# EAGLE design ISA Ouderen - Lamp Ontvanger (EAGLE 6.4)
ABBREV: jn6; PROJECT: JeeNode v6
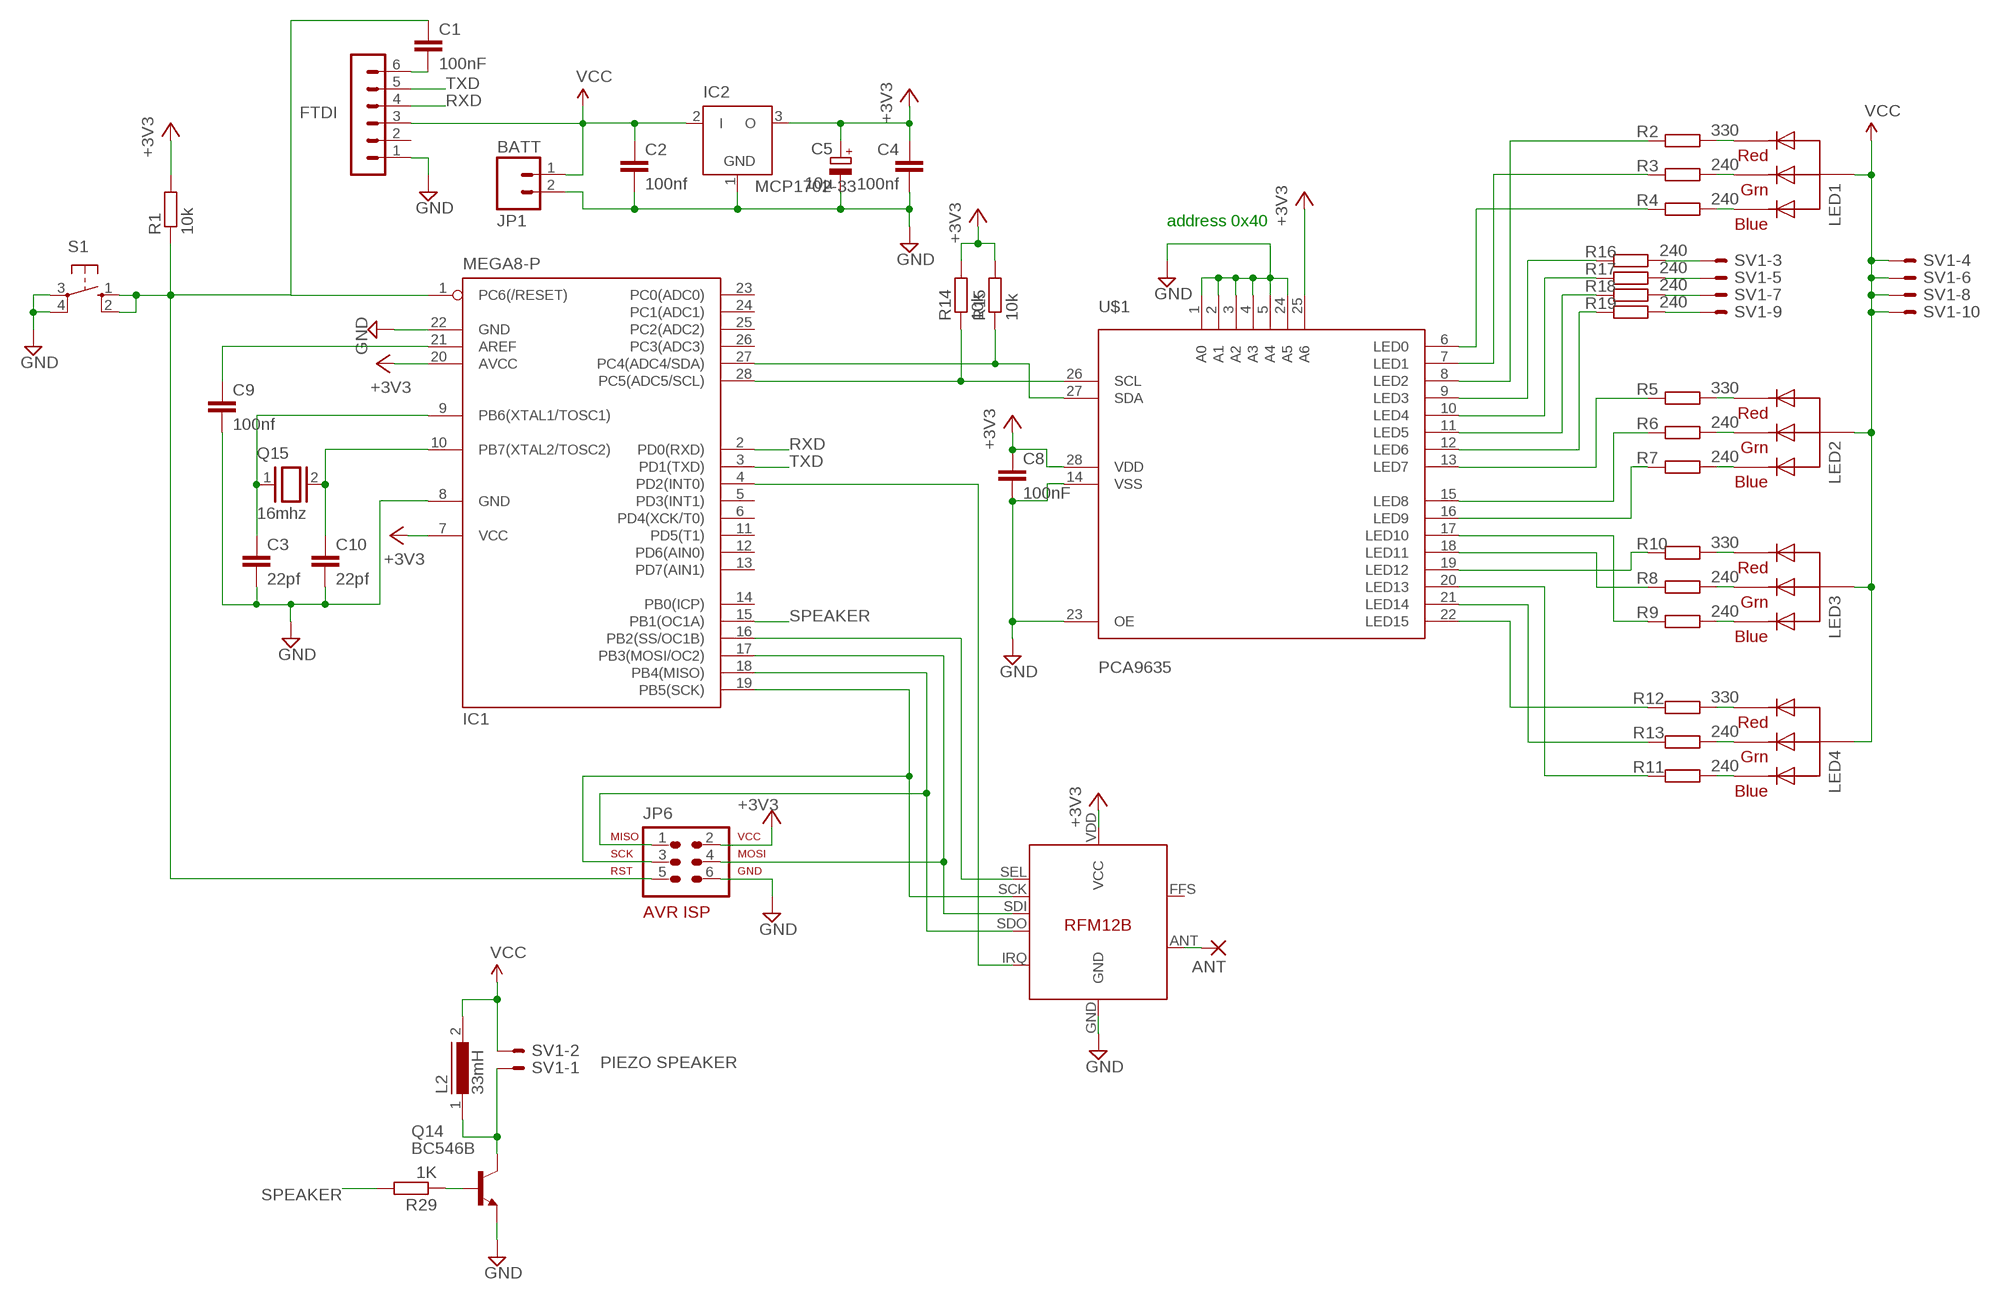
[diagram p0: schematic, sheet 1]

## Parts
ANT  1,6/0,8  [1,6/0,8]
C1  100nF  C-EU025-024X044  [C025-024X044]
C2  100nf  C-EU025-024X044  [C025-024X044]
C3  22pf  C-EU025-024X044  [C025-024X044]
C4  100nf  C-EU025-024X044  [C025-024X044]
C5  10µ  CPOL-EUE1.8-4  [E1,8-4]
C8  100nF  C-EU025-024X044  [C025-024X044]
C9  100nf  C-EU025-024X044  [C025-024X044]
C10  22pf  C-EU025-024X044  [C025-024X044]
FTDI  FTDI  MA06-1  [MA06-1]
IC1  MEGA8-P  [DIL28-3]
IC2  MCP1702-33  MCP1702Z  [TO92]
JP1  BATT  M02LOCK_LONGPADS  [1X02_LOCK_LONGPADS]
JP6  AVR-ISP-6VERT  [AVR-ISP-6]
L2  33mH  82114R  [82114R]
LED1  RGBLED_CA-5MM  [LED5MMRGB]
LED2  RGBLED_CA-5MM  [LED5MMRGB]
LED3  RGBLED_CA-5MM  [LED5MMRGB]
LED4  RGBLED_CA-5MM  [LED5MMRGB]
Q14  BC546B  [TO92-EBC]
Q15  16mhz  XTAL/S  [QS]
R1  10k  R-EU_0207/7  [0207/7]
R2  330  R-EU_0207/7  [0207/7]
R3  240  R-EU_0207/7  [0207/7]
R4  240  R-EU_0207/7  [0207/7]
R5  330  R-EU_0207/7  [0207/7]
R6  240  R-EU_0207/7  [0207/7]
R7  240  R-EU_0207/7  [0207/7]
R8  240  R-EU_0207/7  [0207/7]
R9  240  R-EU_0207/7  [0207/7]
R10  330  R-EU_0207/7  [0207/7]
R11  240  R-EU_0207/7  [0207/7]
R12  330  R-EU_0207/7  [0207/7]
R13  240  R-EU_0207/7  [0207/7]
R14  10k  R-EU_0207/7  [0207/7]
R15  10k  R-EU_0207/7  [0207/7]
R16  240  R-EU_0207/2V  [0207/2V]
R17  240  R-EU_0207/2V  [0207/2V]
R18  240  R-EU_0207/2V  [0207/2V]
R19  240  R-EU_0207/2V  [0207/2V]
R29  1K  R-EU_0207/7  [0207/7]
S1  10-XX  [B3F-10XX]
SV1  ML10LE  [ML10L]
U$1  PCA9635  [PCA9635]
U$3  RFM12B  [RFM12B]

## Nets
+3V3: C4.1 C5.+ C8.1 IC1.7(VCC) IC1.20(AVCC) IC2.3(O) JP6.2 R1.2 R14.2 R15.2 U$1.25(A6) U$1.28(VDD) U$3.VDD(VCC)
GND [power]: C2.2 C3.2 C4.2 C5.- C8.2 C9.2 C10.2 FTDI.1 IC1.8(GND) IC1.22(GND) IC2.1(GND) JP1.2 JP6.6 Q14.E S1.3(P) S1.4(P1) U$1.1(A0) U$1.2(A1) U$1.3(A2) U$1.4(A3) U$1.5(A4) U$1.14(VSS) U$1.23(OE) U$1.24(A5) U$3.GND
N$1: C3.1 IC1.9(PB6(XTAL1/TOSC1)) Q15.1
N$2: IC1.28(PC5(ADC5/SCL)) R14.1 U$1.26(SCL)
N$3: ANT.1(P) U$3.ANT
N$4: IC1.16(PB2(SS/OC1B)) U$3.SEL
N$5: LED1.1(RED) R2.2
N$6: LED1.3(GREEN) R3.2
N$7: IC1.4(PD2(INT0)) U$3.IRQ
N$8: LED1.4(BLUE) R4.2
N$9: LED2.1(RED) R5.2
N$10: IC1.27(PC4(ADC4/SDA)) R15.1 U$1.27(SDA)
N$11: LED2.3(GREEN) R6.2
N$12: LED2.4(BLUE) R7.2
N$13: IC1.18(PB4(MISO)) JP6.1 U$3.SDO
N$14: LED3.1(RED) R10.2
N$15: LED3.3(GREEN) R8.2
N$16: LED3.4(BLUE) R9.2
N$17: LED4.1(RED) R12.2
N$18: LED4.3(GREEN) R13.2
N$19: IC1.19(PB5(SCK)) JP6.3 U$3.SCK
N$20: C1.2 FTDI.6
N$21: C10.1 IC1.10(PB7(XTAL2/TOSC2)) Q15.2
N$22: LED4.4(BLUE) R11.2
N$23: R12.1 U$1.22(LED15)
N$24: R13.1 U$1.21(LED14)
N$25: R11.1 U$1.20(LED13)
N$26: R10.1 U$1.19(LED12)
N$27: R16.1 U$1.9(LED3)
N$28: R8.1 U$1.18(LED11)
N$29: R16.2 SV1.3
N$31: R7.1 U$1.16(LED9)
N$32: R17.1 U$1.10(LED4)
N$33: R2.1 U$1.8(LED2)
N$34: R3.1 U$1.7(LED1)
N$35: R4.1 U$1.6(LED0)
N$36: R18.1 U$1.11(LED5)
N$37: R19.1 U$1.12(LED6)
N$38: R9.1 U$1.17(LED10)
N$39: R5.1 U$1.13(LED7)
N$40: R17.2 SV1.5
N$41: R18.2 SV1.7
N$42: R19.2 SV1.9
N$43: R6.1 U$1.15(LED8)
N$49: C9.1 IC1.21(AREF)
N$51: IC1.17(PB3(MOSI/OC2)) JP6.4 U$3.SDI
N$84: L2.1 Q14.C SV1.1
N$85: Q14.B R29.1
RST: C1.1 IC1.1(PC6(/RESET)) JP6.5 R1.1 S1.1(S) S1.2(S1)
RXD: FTDI.4 IC1.2(PD0(RXD))
SPEAKER: IC1.15(PB1(OC1A)) R29.2
TXD: FTDI.5 IC1.3(PD1(TXD))
VCC [power]: C2.1 FTDI.3 IC2.2(I) JP1.1 L2.2 LED1.2(VCC) LED2.2(VCC) LED3.2(VCC) LED4.2(VCC) SV1.2 SV1.4 SV1.6 SV1.8 SV1.10
Unconnected: FTDI.2 IC1.5(PD3(INT1)) IC1.6(PD4(XCK/T0)) IC1.11(PD5(T1)) IC1.12(PD6(AIN0)) IC1.13(PD7(AIN1)) IC1.14(PB0(ICP)) IC1.23(PC0(ADC0)) IC1.24(PC1(ADC1)) IC1.25(PC2(ADC2)) IC1.26(PC3(ADC3)) U$3.FFS

## Notes on the sheet
- address 0x40
- PIEZO SPEAKER

## Library data of the parts
ANT = JeeLabs:1,6/0,8: THROUGH-HOLE PAD
C1-C4 C8-C10 = resistor:C-EU: CAPACITOR, European symbol
C5 = resistor:CPOL-EU: POLARIZED CAPACITOR, European symbol
FTDI = JeeLabs:MA06-1: PIN HEADER
IC1 = atmel:MEGA8-P: MICROCONTROLLER 8 Kbytes FLASH, 1 kbytes SRAM, 512 bytes EEPROM, USART, 4-channel 10 bit ADC, 2-channel 8 bit ADC Pin compatible with Atmega48, ATMega88, ATMega168 Source: avr.lbr; OC_FARNELL: unknown; OC_NEWARK: unknown
IC2 = JeeLabs:MCP1702: 200 mA, Low Power Low Dropout Voltage Regulator
JP1 = SparkFun:M02: Header 2 Standard 2-pin 0.1" header. Use with straight break away headers (SKU : PRT-00116), right angle break away headers (PRT-00553), swiss pins (PRT-00743), machine pins (PRT-00117), and female headers (PRT-00115). Molex polarized connector foot print use with SKU : PRT-08233 with associated crimp pins and housings.
JP6 = avr-7:AVR-ISP-6: AVR ISP-6 Serial Programming Header
L2 = inductors:82114R: INDUCTOR
LED1-LED4 = adafruit:RGBLED_CA: RGB LED, common-anode 5MM Staggered pins 5mm Piranha package http://www.ladyada.net/library/pcb/eaglelibrary.html
Q14 = transistor-npn:BC546*: NPN Transistor
Q15 = special:XTAL/S: CRYSTAL
R1-R19 R29 = resistor:R-EU_: RESISTOR, European symbol
S1 = switch-omron:10-XX: OMRON SWITCH; MPN: B3F-1000; OC_FARNELL: 176432; OC_NEWARK: 36M3542
SV1 = con-ml:ML10LE: HARTING; OC_FARNELL: unknown; OC_NEWARK: unknown
U$1 = NPX PCA9635:PCA9635: 16 pin PWM with 8 bit per-channel PWM, and 7 bit group PWM on I2C bus
U$3 = JeeParts:RFM12B

## Net classes
1 power: width 0.203 mm, clearance 0.254 mm

## Board
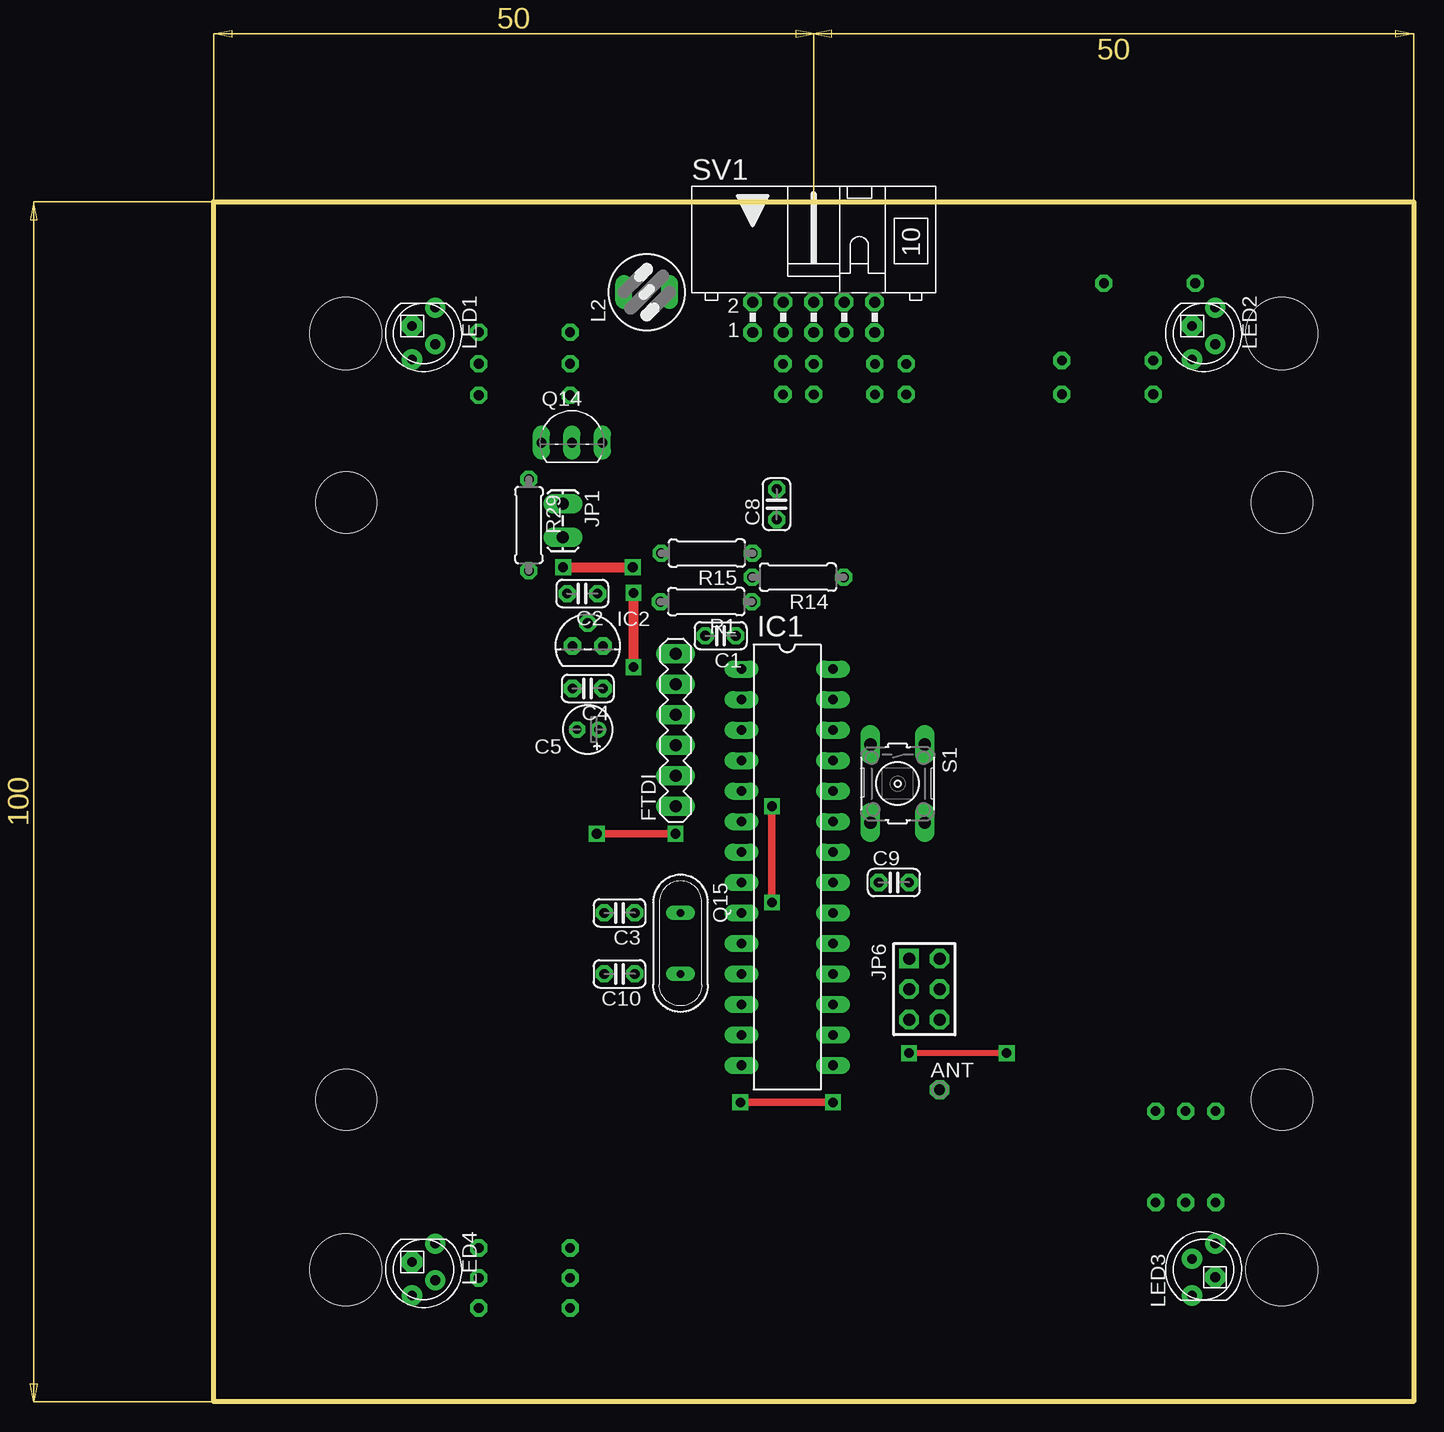
[diagram p1: board, top side]
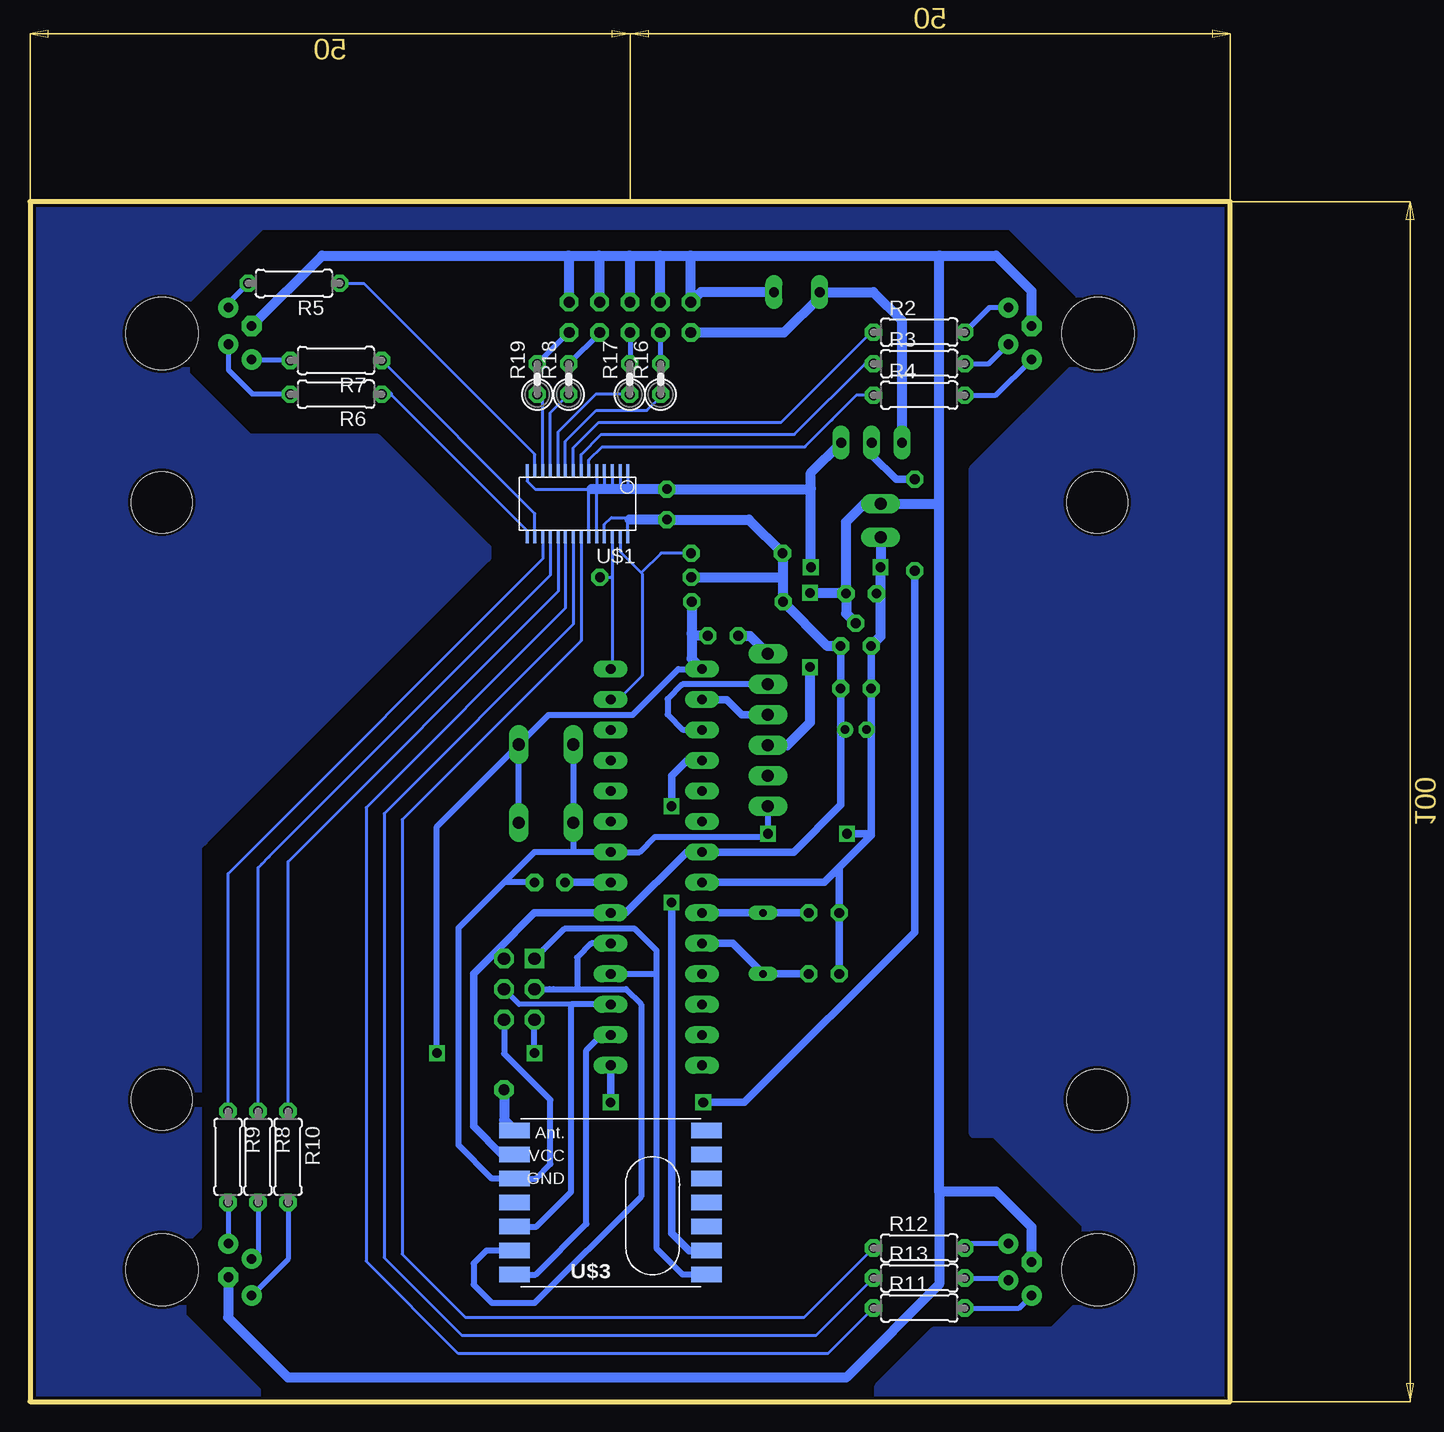
[diagram p2: board, bottom side, seen from below]

Size 100 x 100 mm. Coordinates in mm from the lower left corner, seen from the top.
Outline: 0,0 0,100 100,100 100,0 0,0
Copper layers (1*16): Top 0.035mm / dielectric 1.5mm / Bottom 0.035mm
Design rules "Sparkfun *": minimum track width 8mil, minimum drill 20mil, track to track 8mil, track to pad 8mil, pad to pad 8mil, via to via 8mil, smd to smd 8mil, copper to edge 10mil, drill to drill 8mil, minimum pad ring 12mil, minimum via ring 10mil, stop-mask expansion 4mil, vias tented up to drill 25mil, thermal gap 10mil
Holes 6 mm at 89,89 11,89 89,11 11,11
Holes 5.08 mm at 89.03,74.93 89.03,25.15 11.05,25.15 11.05,74.93

### Footprints (pad centres in the part's own frame; a part is rotated, then mirrored left to right if it is on the bottom)
1,6/0,8 = drill 0.9 pad 1.6 octagon: 1 0,0
C025-024X044 = drill 0.813 octagon: 1 -1.27,0; 2 1.27,0
E1,8-4 = drill 0.711 pad 1.168: + -0.889,0 | drill 0.711 pad 1.168 octagon: - 0.889,0
MA06-1 = drill 1.016 long: 1 0,0; 2 2.54,0; 3 5.08,0; 4 7.62,0; 5 10.16,0; 6 12.7,0
DIL28-3 = drill 0.813 long: 1 -16.51,-3.81; 2 -13.97,-3.81; 3 -11.43,-3.81; 4 -8.89,-3.81; 5 -6.35,-3.81; 6 -3.81,-3.81; 7 -1.27,-3.81; 8 1.27,-3.81; 9 3.81,-3.81; 10 6.35,-3.81; 11 8.89,-3.81; 12 11.43,-3.81; 13 13.97,-3.81; 14 16.51,-3.81; 15 16.51,3.81; 16 13.97,3.81; 17 11.43,3.81; 18 8.89,3.81; 19 6.35,3.81; 20 3.81,3.81; 21 1.27,3.81; 22 -1.27,3.81; 23 -3.81,3.81; 24 -6.35,3.81; 25 -8.89,3.81; 26 -11.43,3.81; 27 -13.97,3.81; 28 -16.51,3.81
TO92 = drill 0.813 octagon: 1 -1.27,0; 2 0,1.905; 3 1.27,0
1X02_LOCK_LONGPADS = drill 1.016 long: 1 -0.127,0; 2 2.667,0
AVR-ISP-6 = drill 1.016 square: 1 -2.54,-1.27 | drill 1.016 octagon: 2 -2.54,1.27; 3 0,-1.27; 4 0,1.27; 5 2.54,-1.27; 6 2.54,1.27
82114R = drill 0.813 long: 1 0,1.905; 2 0,-1.905
LED5MMRGB = drill 0.8 pad 1.676: 1 -2.159,0.968; 3 0.889,0.968; 4 2.159,-0.968 | drill 0.8 pad 1.676 octagon: 2 -0.635,-0.968
TO92-EBC = drill 0.813 long: B 0,-1.27; C -2.54,-1.27; E 2.54,-1.27
QS = drill 0.61 long: 1 -2.54,0; 2 2.54,0
0207/7 = drill 0.813 octagon: 1 -3.81,0; 2 3.81,0
0207/2V = drill 0.813 octagon: 1 -1.27,0; 2 1.27,0
B3F-10XX = drill 1.016 long: 1 -3.251,2.261; 2 3.251,2.261; 3 -3.251,-2.261; 4 3.251,-2.261
ML10L = drill 0.914 octagon: 1 -5.08,-1.27; 2 -5.08,1.27; 3 -2.54,-1.27; 4 -2.54,1.27; 5 0,-1.27; 6 0,1.27; 7 2.54,-1.27; 8 2.54,1.27; 9 5.08,-1.27; 10 5.08,1.27
PCA9635 = smd 0.25 x 1: 1 0.65,-0.6; 2 1.3,-0.6; 3 1.95,-0.6; 4 2.6,-0.6; 5 3.25,-0.6; 6 3.9,-0.6; 7 4.55,-0.6; 8 5.2,-0.6; 9 5.85,-0.6; 10 6.45,-0.6; 11 7.1,-0.6; 12 7.75,-0.6; 13 8.4,-0.6; 14 9.05,-0.6; 15 9.05,5; 16 8.4,5; 17 7.75,5; 18 7.1,5; 19 6.45,5; 20 5.85,5; 21 5.2,5; 22 4.55,5; 23 3.9,5; 24 3.25,5; 25 2.6,5; 26 1.95,5; 27 1.3,5; 28 0.65,5
RFM12B = smd 2.54 x 1.27: ANT 8,-6; FFS -8,2; GND 8,-2; IRQ -8,4; P$8 -8,0; P$9 -8,-2; P$10 -8,-4; P$12 -8,-6; P$16 8,0; SCK 8,4; SDI 8,2; SDO -8,6; SEL 8,6; VDD 8,-4

### Placement (x,y rotation side)
ANT  60.5,25.99 0 top
C1  42.25,63.82 180 top
C2  30.73,67.34 180 top
C3  33.83,40.72 180 top
C4  31.18,59.43 180 top
C5  31.18,56 180 top
C8  46.92,74.77 90 top
C9  56.69,43.26 0 top
C10  33.83,35.64 180 top
FTDI  38.51,49.61 90 top
IC1  47.8,44.53 270 top
IC2  31.18,62.96 0 top
JP1  29.11,74.69 270 top
JP6  59.23,34.37 270 top
L2  36.1,92.45 90 top
LED1  17.5,89 270 top
LED2  82.5,89 270 top
LED3  82.5,11 90 top
LED4  17.5,11 270 top
Q14  29.86,81.18 0 top
Q15  38.91,38.18 270 top
R1  41.05,66.66 180 top
R2  25.9,89.12 0 bottom
R3  25.9,86.49 0 bottom
R4  25.9,83.87 0 bottom
R5  78,93.19 180 bottom
R6  74.5,83.95 180 bottom
R7  74.5,86.76 180 bottom
R8  81,20.4 270 bottom
R9  83.5,20.4 270 bottom
R10  78.5,20.4 270 bottom
R11  25.9,7.8 0 bottom
R12  25.9,12.8 0 bottom
R13  25.9,10.3 0 bottom
R14  48.7,68.7 180 top
R15  41.1,70.7 180 top
R16  47.45,85.2 90 bottom
R17  50.02,85.2 90 bottom
R18  55.11,85.2 90 bottom
R19  57.73,85.2 90 bottom
R29  26.27,73.04 270 top
S1  57,51.5 270 top
SV1  50,90.36 0 top
U$1  49.53,77.01 180 bottom
U$3  51.61,16.59 180 bottom

### Tracks (layer width: path | path; a pad name or v marks a point on that pad's centre or on a via)
+3V3
  Bottom 0.254: U$1.28 50.18,73.36 50.04,73.5 | U$1.25 52.13,73.09 51.56,73.66 49.94,73.66 49.78,73.5
  Bottom 0.61: 61.13,37.55 57.96,40.72 IC1.20 50.34,40.72 45.26,45.8 IC1.7 36.37,45.8 32.45,49.72 32.45,55.88 | 61.13,37.55 63.04,35.64 63.04,22.94 60.69,20.59 U$3.VDD | JP6.2 61.13,37.55 | IC2.3 C4.1 32.45,55.88 | C5.+ 32.33,56 32.45,55.88
  Bottom 0.813: 37.2,70.61 R15.2 | 37.24,68.6 R1.2 33.54,62.96 IC2.3 | 37.24,68.6 37.24,70.65 R15.2 | R14.2 37.34,68.7 37.24,68.6 | R15.2 40.09,73.5 C8.1 49.78,73.5 50.04,73.5
GND  (via drill 0.8)
  Top 0.61: v38.49,47.32 v31.93,47.32
  Top 0.813: v29.13,69.53 v34.93,69.53
  Bottom 0.254: U$1.14 58.58,76.71 57.91,76.04 53.09,76.04 | U$1.1 50.18,76.28 50.42,76.04 | U$1.2 50.83,76.07 50.8,76.04 | U$1.3 51.48,76.21 51.31,76.04 | U$1.4 52.13,76.11 52.2,76.04 | U$1.5 52.78,76.09 52.83,76.04 52.78,75.99 U$1.24 | U$1.23 53.43,75.82 53.21,76.04
  Bottom 0.508: 54.86,45.8 IC1.22 49.2,45.8 47.93,47.07 38.75,47.07 v38.49,47.32 38.51,47.34 FTDI.1 | 54.86,45.8 57.96,45.8 60.5,43.26 | 60.5,43.26 64.31,39.45 64.31,21.38 61.52,18.59 U$3.GND 57.86,18.59 56.64,19.81 56.64,25.15 60.5,29 JP6.6 | C9.2 60.5,43.26 | S1.3 S1.4 54.74,45.92 54.86,45.8
  Bottom 0.61: C10.2 C3.2 32.56,44.37 32.64,44.45 | IC2.1 C4.2 29.91,56.01 | 29.91,56.01 29.91,47.5 | 29.91,47.5 29.91,47.18 32.64,44.45 | C5.- 29.92,56 29.91,56.01 | 32.64,44.45 33.83,43.26 IC1.8 | v31.93,47.32 30.08,47.32 29.91,47.5
  Bottom 0.813: v29.13,69.53 29.13,69 | 29.13,69 29.13,67.4 | C2.2 29.2,67.34 29.13,67.4 | v34.93,69.53 34.93,76.07 | 34.93,76.07 34.93,77.39 Q14.E | JP1.2 29.11,69.02 29.13,69 | 34.93,76.07 34.96,76.04 C8.2 50.42,76.04 50.8,76.04 51.31,76.04 52.2,76.04 52.83,76.04 53.09,76.04 53.21,76.04 | 29.13,67.4 29.13,63.74 IC2.1
N$1
  Bottom 0.61: IC1.9 Q15.1 C3.1
N$2
  Bottom 0.254: U$1.26 51.48,68.8 | 51.48,68.8 51.48,61.17 IC1.28 | R14.1 51.58,68.7 51.48,68.8
N$3
  Bottom 0.813: ANT.1 60.5,23.48 U$3.ANT
N$4
  Bottom 0.508: U$3.SEL 57.86,10.59 53.64,14.81 53.64,29.29 52.37,30.56 IC1.16
N$5
  Bottom 0.406: LED1.1 20.05,91.16 R2.2
N$6
  Bottom 0.406: R3.2 20.09,86.49 LED1.3
N$7  (via drill 0.8)
  Top 0.61: v46.53,49.61 v46.53,41.59
  Bottom 0.61: IC1.4 45.26,53.42 46.53,52.15 v46.53,49.61 | v46.53,41.59 46.53,14.05 45.07,12.59 U$3.IRQ
N$8
  Bottom 0.406: R4.2 19.51,83.87 LED1.4
N$9
  Bottom 0.406: LED2.1 83.47,91.53 R5.2
N$10
  Bottom 0.254: U$1.27 50.83,70.83 49.05,69.06 | IC1.27 51,58.5 49,60.5 49,69 49.05,69.06 | R15.1 47.41,70.7 49.05,69.06
N$11
  Bottom 0.406: LED2.3 83.47,85.98 81.44,83.95 R6.2
N$12
  Bottom 0.406: R7.2 81.45,86.76 LED2.4
N$13
  Bottom 0.508: 47.8,35.6 47.8,37.6 49.6,39.4 55.47,39.4 JP6.1 | 47.8,35.6 47.8,12.78 45.61,10.59 U$3.SDO | IC1.18 47.84,35.64 47.8,35.6
N$14
  Bottom 0.406: R10.2 78.5,11.87 LED3.1
N$15
  Bottom 0.406: R8.2 81,12.42 LED3.3
N$16
  Bottom 0.406: R9.2 83.5,13.19 LED3.4
N$17
  Bottom 0.406: LED4.1 21.73,13.16 R12.2
N$18
  Bottom 0.406: R13.2 18.66,10.3 LED4.3
N$19
  Bottom 0.508: 54.4,34.37 56.39,34.37 56.69,34.37 JP6.3 | 54.4,34.37 50.34,34.37 49.07,33.1 49.07,17.09 57.96,8.2 61.5,8.2 63.04,9.74 63.04,11.51 61.96,12.59 U$3.SCK | IC1.19 53.22,38.18 54.4,37 54.4,34.37
N$20
  Bottom 0.813: C1.2 40.02,63.82 FTDI.6
N$21
  Bottom 0.61: IC1.10 41.45,38.18 Q15.2 C10.1
N$22
  Bottom 0.406: R11.2 17.57,7.8 LED4.4
N$23
  Bottom 0.254: U$1.22 54.08,63.42 69,48.5 69,12.3 63.7,7 35.51,7 R12.1
N$24
  Bottom 0.254: U$1.21 54.73,64.77 70.5,49 70.5,12 64,5.5 34.51,5.5 R13.1
N$25
  Bottom 0.254: R11.1 33.51,4 64.3,4 72,11.7 72,49.5 55.38,66.12 U$1.20
N$26
  Bottom 0.254: R10.1 78.5,45 55.98,67.52 U$1.19
N$27
  Bottom 0.254: U$1.9 55.38,80.02 52.8,82.6 48.6,82.6 47.45,83.75
  Bottom 0.406: R16.1 47.45,83.75
N$28
  Bottom 0.254: U$1.18 56.63,68.87 80.1,45.4 80.7,44.8 81,44.5 R8.1
N$29
  Bottom 0.406: R16.2 47.45,88.32 SV1.3
N$30
  pour Bottom: 0,100.08 0,0 29.21,0 29.21,1.27 24.64,5.84 14.73,5.84 11.94,8.64 11.94,14.73 19.56,22.35 21.34,22.35 21.34,77.72 12.45,86.61 12.45,92.2 18.29,98.04 80.77,98.04 87.12,91.69 87.12,85.6 81.79,80.26 71.12,80.26 61.98,71.12 61.98,70.36 85.6,46.74 86.11,46.23 86.11,14.48 87.38,13.21 87.38,7.11 80.26,0 100.08,0 100.08,99.82 99.82,100.08
N$31
  Bottom 0.254: U$1.16 57.93,74 R7.1
N$32
  Bottom 0.254: U$1.10 55.98,80.82 52.87,83.93 R17.1
N$33
  Bottom 0.254: U$1.8 54.73,79.47 52.6,81.6 37.4,81.6 29.88,89.12 R2.1
N$34
  Bottom 0.254: U$1.7 54.08,78.92 52.4,80.6 36.3,80.6 30.41,86.49 R3.1
N$35
  Bottom 0.254: U$1.6 53.43,78.47 52.33,79.57 35.43,79.57 33.18,81.82 32.53,82.47 31.13,83.87 R4.1
N$36
  Bottom 0.254: U$1.11 56.63,82.41 R18.1
N$37
  Bottom 0.254: U$1.12 57.28,83.48 R19.1
N$38
  Bottom 0.254: R9.1 83.5,44 57.28,70.22 U$1.17
N$39
  Bottom 0.254: U$1.13 57.93,78.93 72.19,93.19 R5.1
N$40
  Bottom 0.406: SV1.5 50,86.49 R17.2
N$41
  Bottom 0.406: SV1.7 52.54,89.04 R18.2
N$42
  Bottom 0.406: SV1.9 55.1,89.09 R19.2
N$43
  Bottom 0.254: U$1.15 58.58,72.58 69.95,83.95
  Bottom 0.406: R6.1 69.95,83.95
N$49
  Bottom 0.61: IC1.21 C9.1
N$51
  Bottom 0.406: 54.91,33.1 59.23,33.1 JP6.4
  Bottom 0.508: U$3.SDI 57.8,14.59 54.91,17.48 54.91,33.1 IC1.17
N$84
  Bottom 0.813: Q14.C 27.32,90.06 29.71,92.45 L2.1 34.19,92.05 37.15,89.09 SV1.1
N$85
  Bottom 0.61: R29.1 27.83,76.85 29.84,78.87 29.84,79.89 Q14.B
RST  (via drill 0.8)
  Top 0.508: v66.09,29.04 v57.96,29.04
  Bottom 0.508: v57.96,29.04 JP6.5 | v66.09,29.04 66.09,47.92 S1.1 | S1.1 56.81,57.2 49.8,57.2 45.96,61.04 IC1.1 | S1.2 S1.1
  Bottom 0.813: R1.1 44.86,64 | 44.86,64 44.86,61.91 IC1.1 | C1.1 44.68,63.82 44.86,64
RXD
  Bottom 0.61: IC1.2 41.96,58.5 40.69,57.23 FTDI.4
SPEAKER  (via drill 0.8)
  Top 0.61: v51.61,24.94 v43.89,24.94
  Bottom 0.61: R29.2 26.27,39.13 40.47,24.94 v43.89,24.94 | IC1.15 v51.61,24.94
TXD
  Bottom 0.508: FTDI.5 45.64,59.77 46.86,58.55 46.86,57.28 45.55,55.96 IC1.3
VCC  (via drill 0.8)
  Top 0.813: v35,61.2 v35,67.4
  Bottom 0.813: 55.12,95.5 75.67,95.5 LED2.2 | 55.12,95.5 52.58,95.5 | 52.58,95.5 50.04,95.5 | 50.04,95.5 47.5,95.5 | 47.5,95.5 44.96,95.5 | 44.96,95.5 24.2,95.5 | 24.2,95.5 19.5,95.5 16.53,92.53 LED1.2 | LED3.2 83.5,10.33 83.5,7 78.5,2 32,2 24.24,9.76 24.24,17.5 | v35,61.2 35,56.6 36.91,54.69 FTDI.3 | v35,67.4 32,67.4 | 32,67.4 C2.1 32,65.69 IC2.2 | 32,67.4 32,73.31 30.49,74.81 JP1.1 24.46,74.81 24.24,74.59 | LED4.2 16.53,14.53 19.5,17.5 24.24,17.5 | 24.24,17.5 24.24,74.59 | 24.24,74.59 24.24,95.46 24.2,95.5 | L2.2 44.1,92.45 SV1.2 44.92,95.46 44.96,95.5 | SV1.10 55.08,95.46 55.12,95.5 | SV1.8 52.54,95.46 52.58,95.5 | SV1.6 50,95.46 50.04,95.5 | SV1.4 47.46,95.46 47.5,95.5